# Altium schematic sheet FRONT_PL_v1.SchDoc: SDR200
size 420 x 297 mm; DocumentNumber: XXXX.468179.001 Э3; SheetNumber: 2; SheetTotal: 7; Title2str: Передняя панель; DocumentType: Схема электрическая принципиальная; Scale: 1:1
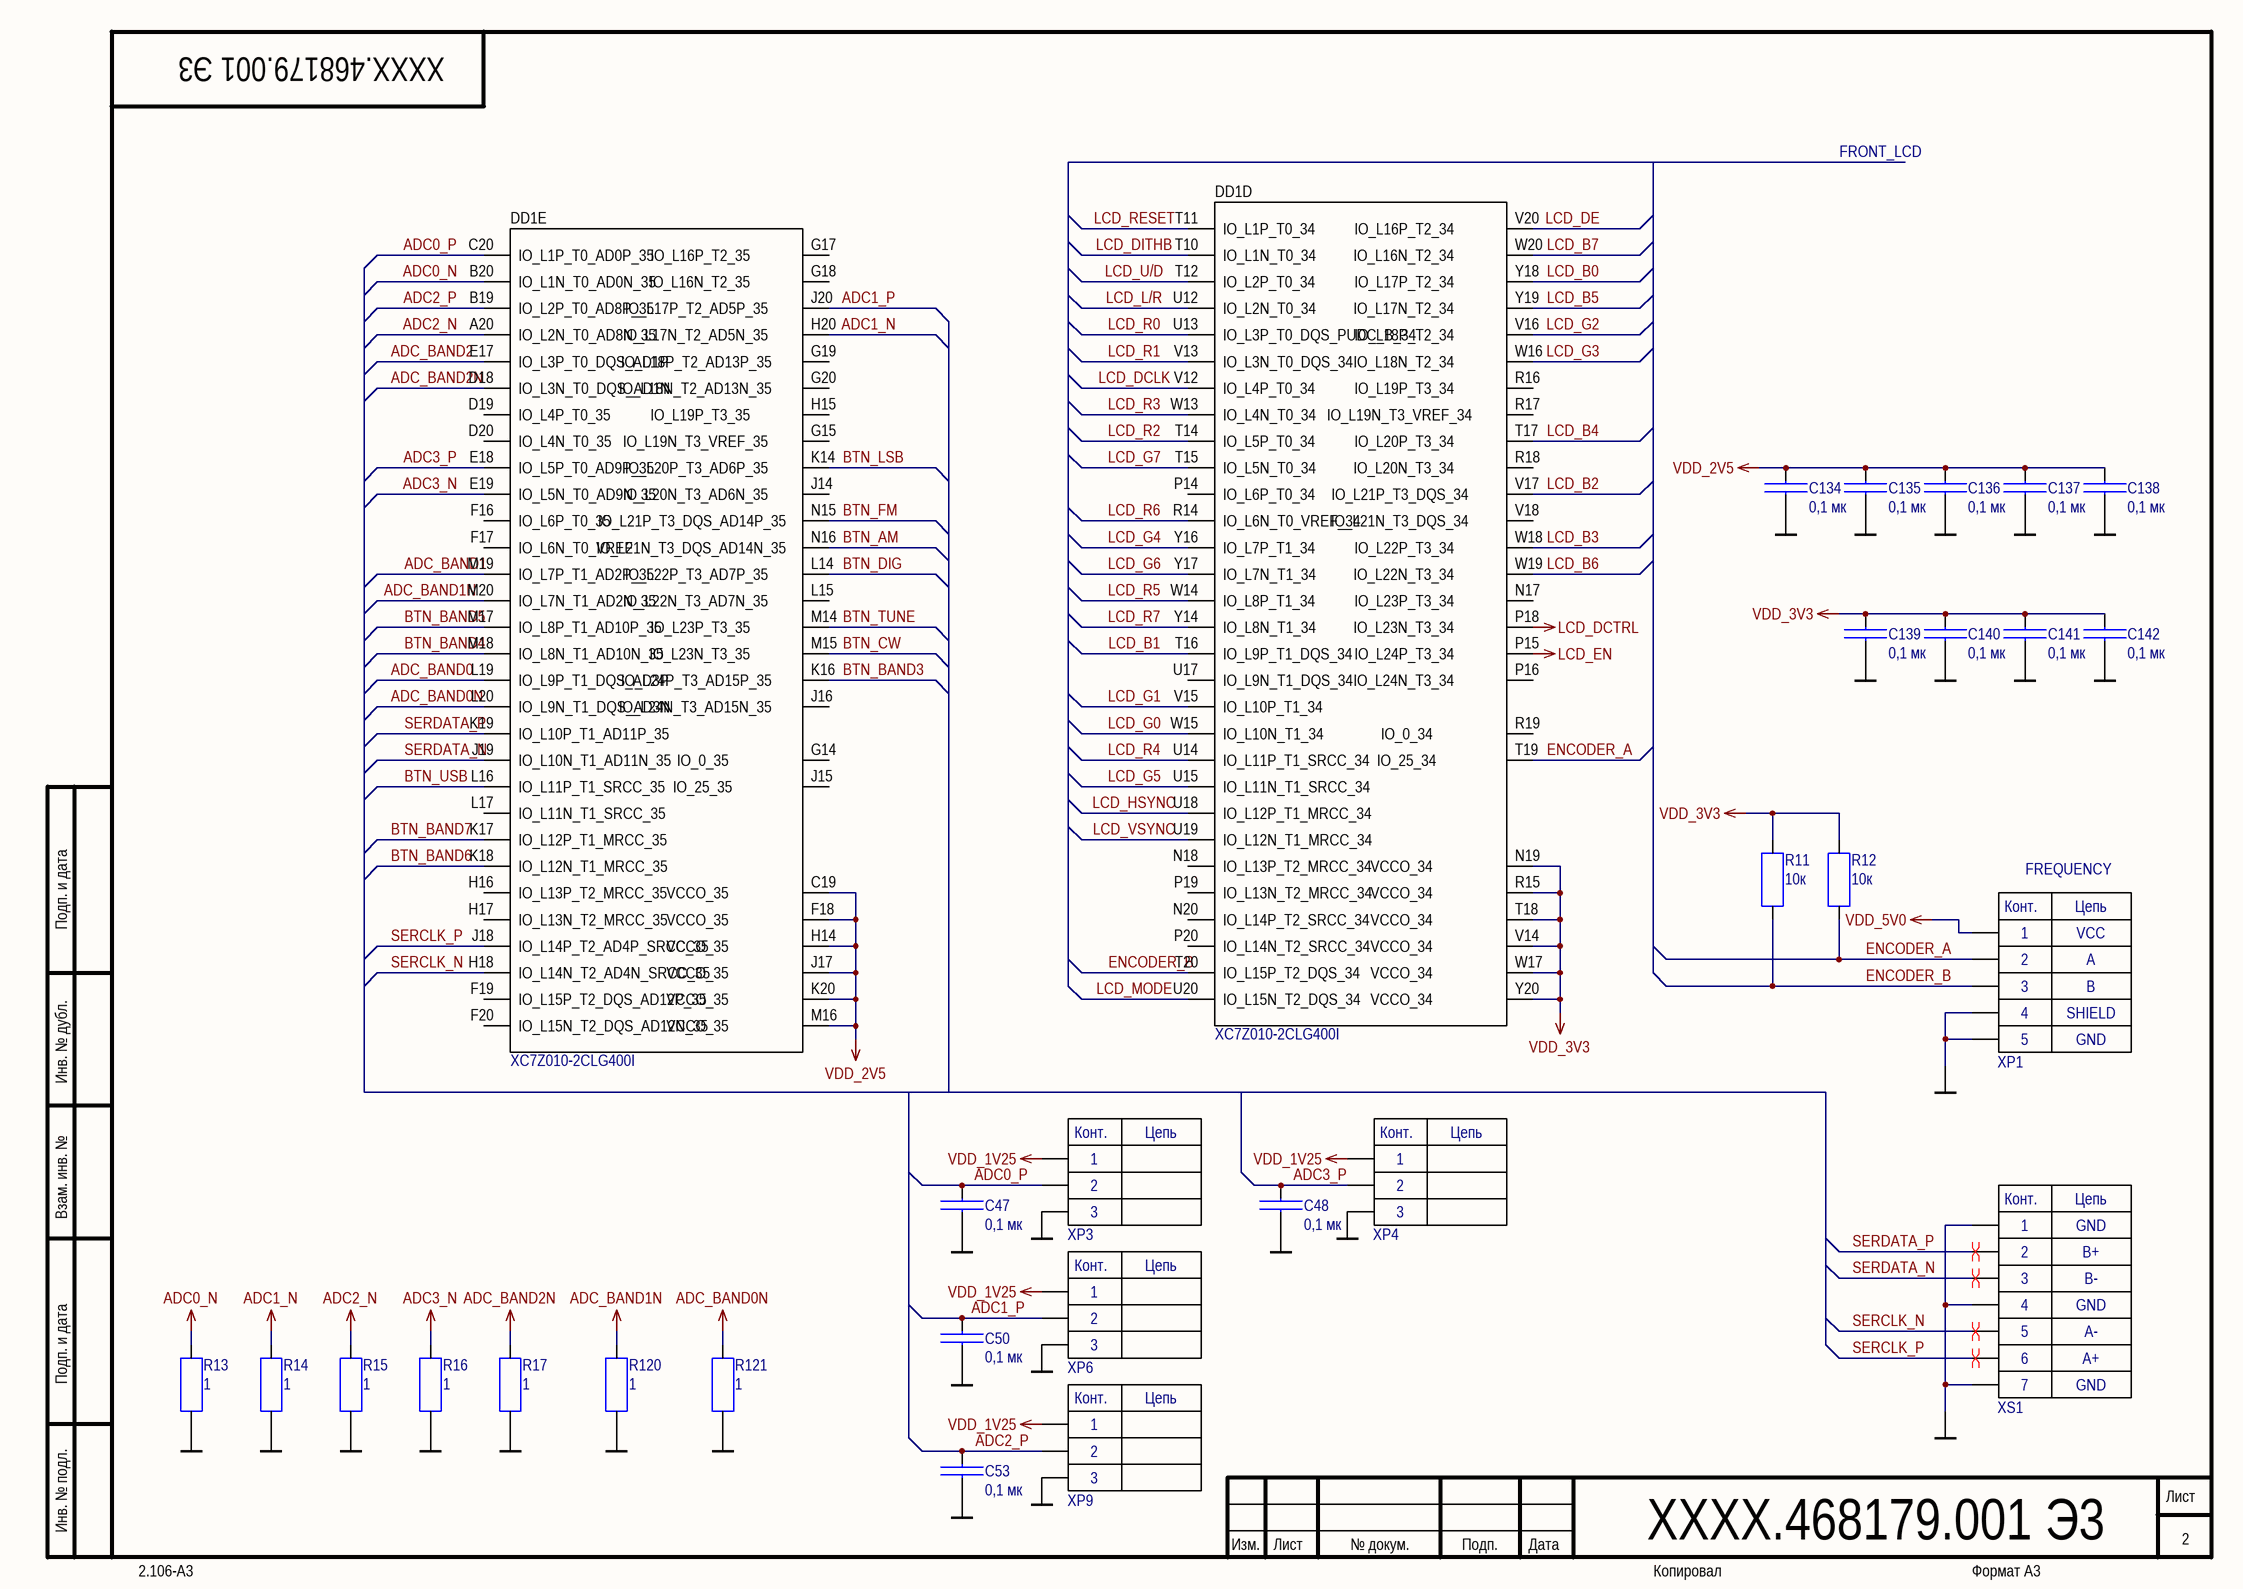
[diagram p0: FRONT_PL_v1.SchDoc]

## Parts
C47  Nominal: 0,1 мк  [CAPC1005X05L]  (hidden comment: CC0402KRX5R6BB104)
C48  Nominal: 0,1 мк  [CAPC1005X05L]  (hidden comment: CC0402KRX5R6BB104)
C50  Nominal: 0,1 мк  [CAPC1005X05L]  (hidden comment: CC0402KRX5R6BB104)
C53  Nominal: 0,1 мк  [CAPC1005X05L]  (hidden comment: CC0402KRX5R6BB104)
C134  Nominal: 0,1 мк  [CAPC1005X05L]  (hidden comment: CC0402KRX5R6BB104)
C135  Nominal: 0,1 мк  [CAPC1005X05L]  (hidden comment: CC0402KRX5R6BB104)
C136  Nominal: 0,1 мк  [CAPC1005X05L]  (hidden comment: CC0402KRX5R6BB104)
C137  Nominal: 0,1 мк  [CAPC1005X05L]  (hidden comment: CC0402KRX5R6BB104)
C138  Nominal: 0,1 мк  [CAPC1005X05L]  (hidden comment: CC0402KRX5R6BB104)
C139  Nominal: 0,1 мк  [CAPC1005X05L]  (hidden comment: CC0402KRX5R6BB104)
C140  Nominal: 0,1 мк  [CAPC1005X05L]  (hidden comment: CC0402KRX5R6BB104)
C141  Nominal: 0,1 мк  [CAPC1005X05L]  (hidden comment: CC0402KRX5R6BB104)
C142  Nominal: 0,1 мк  [CAPC1005X05L]  (hidden comment: CC0402KRX5R6BB104)
DD1  XC7Z010-2CLG400I  [BGA400C80P20X20_1700X1700X147]  (parts D,E of 7)
R11  Nominal: 10к  [RESC1005X04L]  (hidden comment: RC0402JR-0710KL)
R12  Nominal: 10к  [RESC1005X04L]  (hidden comment: RC0402JR-0710KL)
R13  Nominal: 1  [RESC1005X04L]  (hidden comment: RC0402JR-071RL)
R14  Nominal: 1  [RESC1005X04L]  (hidden comment: RC0402JR-071RL)
R15  Nominal: 1  [RESC1005X04L]  (hidden comment: RC0402JR-071RL)
R16  Nominal: 1  [RESC1005X04L]  (hidden comment: RC0402JR-071RL)
R17  Nominal: 1  [RESC1005X04L]  (hidden comment: RC0402JR-071RL)
R120  Nominal: 1  [RESC1005X04L]  (hidden comment: RC0402JR-071RL)
R121  Nominal: 1  [RESC1005X04L]  (hidden comment: RC0402JR-071RL)
XP1  WB-05  [WB-05 (MW-5M) pitch 2.00mm]  (value not drawn)
XP3  WB-03  [WB-03 (MW-3M) PITCH 2.00MM]  (value not drawn)
XP4  WB-03  [WB-03 (MW-3M) PITCH 2.00MM]  (value not drawn)
XP6  WB-03  [WB-03 (MW-3M) PITCH 2.00MM]  (value not drawn)
XP9  WB-03  [WB-03 (MW-3M) PITCH 2.00MM]  (value not drawn)
XS1  KLS1-SATA001  [KLS1-SATA001]  (value not drawn)

## Nets
ADC0_N: DD1.B20(IO_L1N_T0_AD0N_35) R13.2
ADC1_N: DD1.H20(IO_L17N_T2_AD5N_35) R14.2
ADC2_N: DD1.A20(IO_L2N_T0_AD8N_35) R15.2
ADC3_N: DD1.E19(IO_L5N_T0_AD9N_35) R16.2
ADC_BAND0N: DD1.L20(IO_L9N_T1_DQS_AD3N) R121.2
ADC_BAND1N: DD1.M20(IO_L7N_T1_AD2N_35) R120.2
ADC_BAND2N: DD1.D18(IO_L3N_T0_DQS_AD1N) R17.2
GND: C47.1 C48.1 C50.1 C53.1 C134.1 C135.1 C136.1 C137.1 C138.1 C139.1 C140.1 C141.1 C142.1 R13.1 R14.1 R15.1 R16.1 R17.1 R120.1 R121.1 XP1.4 XP1.5 XP3.3 XP4.3 XP6.3 XP9.3 XS1.1 XS1.4 XS1.7
LCD_DCTRL: DD1.P18(IO_L23N_T3_34)
LCD_EN: DD1.P15(IO_L24P_T3_34)
VDD_1V25: XP3.1 XP4.1 XP6.1 XP9.1
VDD_2V5: C134.2 C135.2 C136.2 C137.2 C138.2 DD1.C19(VCCO_35) DD1.F18(VCCO_35) DD1.H14(VCCO_35) DD1.J17(VCCO_35) DD1.K20(VCCO_35) DD1.M16(VCCO_35)
VDD_3V3: C139.2 C140.2 C141.2 C142.2 DD1.N19(VCCO_34) DD1.R15(VCCO_34) DD1.T18(VCCO_34) DD1.V14(VCCO_34) DD1.W17(VCCO_34) DD1.Y20(VCCO_34) R11.1 R12.1
VDD_5V0: XP1.1
ADC0_P: C47.2 DD1.C20(IO_L1P_T0_AD0P_35) XP3.2
ADC1_P: C50.2 DD1.J20(IO_L17P_T2_AD5P_35) XP6.2
ADC2_P: C53.2 DD1.B19(IO_L2P_T0_AD8P_35) XP9.2
ADC3_P: C48.2 DD1.E18(IO_L5P_T0_AD9P_35) XP4.2
ADC_BAND0: DD1.L19(IO_L9P_T1_DQS_AD3P)
ADC_BAND1: DD1.M19(IO_L7P_T1_AD2P_35)
ADC_BAND2: DD1.E17(IO_L3P_T0_DQS_AD1P)
BTN_AM: DD1.N16(IO_L21N_T3_DQS_AD14N_35)
BTN_BAND3: DD1.K16(IO_L24P_T3_AD15P_35)
BTN_BAND4: DD1.M18(IO_L8N_T1_AD10N_35)
BTN_BAND5: DD1.M17(IO_L8P_T1_AD10P_35)
BTN_BAND6: DD1.K18(IO_L12N_T1_MRCC_35)
BTN_BAND7: DD1.K17(IO_L12P_T1_MRCC_35)
BTN_CW: DD1.M15(IO_L23N_T3_35)
BTN_DIG: DD1.L14(IO_L22P_T3_AD7P_35)
BTN_FM: DD1.N15(IO_L21P_T3_DQS_AD14P_35)
BTN_LSB: DD1.K14(IO_L20P_T3_AD6P_35)
BTN_TUNE: DD1.M14(IO_L23P_T3_35)
BTN_USB: DD1.L16(IO_L11P_T1_SRCC_35)
ENCODER_A: DD1.T19(IO_25_34) R12.2 XP1.2
ENCODER_B: DD1.T20(IO_L15P_T2_DQS_34) R11.2 XP1.3
LCD_B0: DD1.Y18(IO_L17P_T2_34)
LCD_B1: DD1.T16(IO_L9P_T1_DQS_34)
LCD_B2: DD1.V17(IO_L21P_T3_DQS_34)
LCD_B3: DD1.W18(IO_L22P_T3_34)
LCD_B4: DD1.T17(IO_L20P_T3_34)
LCD_B5: DD1.Y19(IO_L17N_T2_34)
LCD_B6: DD1.W19(IO_L22N_T3_34)
LCD_B7: DD1.W20(IO_L16N_T2_34)
LCD_DCLK: DD1.V12(IO_L4P_T0_34)
LCD_DE: DD1.V20(IO_L16P_T2_34)
LCD_DITHB: DD1.T10(IO_L1N_T0_34)
LCD_G0: DD1.W15(IO_L10N_T1_34)
LCD_G1: DD1.V15(IO_L10P_T1_34)
LCD_G2: DD1.V16(IO_L18P_T2_34)
LCD_G3: DD1.W16(IO_L18N_T2_34)
LCD_G4: DD1.Y16(IO_L7P_T1_34)
LCD_G5: DD1.U15(IO_L11N_T1_SRCC_34)
LCD_G6: DD1.Y17(IO_L7N_T1_34)
LCD_G7: DD1.T15(IO_L5N_T0_34)
LCD_HSYNC: DD1.U18(IO_L12P_T1_MRCC_34)
LCD_L/R: DD1.U12(IO_L2N_T0_34)
LCD_MODE: DD1.U20(IO_L15N_T2_DQS_34)
LCD_R0: DD1.U13(IO_L3P_T0_DQS_PUDC_B_34)
LCD_R1: DD1.V13(IO_L3N_T0_DQS_34)
LCD_R2: DD1.T14(IO_L5P_T0_34)
LCD_R3: DD1.W13(IO_L4N_T0_34)
LCD_R4: DD1.U14(IO_L11P_T1_SRCC_34)
LCD_R5: DD1.W14(IO_L8P_T1_34)
LCD_R6: DD1.R14(IO_L6N_T0_VREF_34)
LCD_R7: DD1.Y14(IO_L8N_T1_34)
LCD_RESET: DD1.T11(IO_L1P_T0_34)
LCD_U/D: DD1.T12(IO_L2P_T0_34)
LCD_VSYNC: DD1.U19(IO_L12N_T1_MRCC_34)
SERCLK_N: DD1.H18(IO_L14N_T2_AD4N_SRCC_35) XS1.5
SERCLK_P: DD1.J18(IO_L14P_T2_AD4P_SRCC_35) XS1.6
SERDATA_N: DD1.J19(IO_L10N_T1_AD11N_35) XS1.3
SERDATA_P: DD1.K19(IO_L10P_T1_AD11P_35) XS1.2

Not connected (* = marked no-connect by the designer): DD1 D19  (IO_L4P_T0_35_____________) D20  (IO_L4N_T0_35_____________) F16  (IO_L6P_T0_35_____________) F17  (IO_L6N_T0_VREF) F19  (IO_L15P_T2_DQS_AD12P_35__) F20  (IO_L15N_T2_DQS_AD12N_35__) G14  (IO_0_35__________________) G15  (IO_L19N_T3_VREF_35_______) G17  (IO_L16P_T2_35____________) G18  (IO_L16N_T2_35____________) G19  (IO_L18P_T2_AD13P_35______) G20  (IO_L18N_T2_AD13N_35______) H15  (IO_L19P_T3_35____________) H16  (IO_L13P_T2_MRCC_35_______) H17  (IO_L13N_T2_MRCC_35_______) J14  (IO_L20N_T3_AD6N_35_______) J15  (IO_25_35_________________) J16  (IO_L24N_T3_AD15N_35______) L15  (IO_L22N_T3_AD7N_35_______) L17  (IO_L11N_T1_SRCC_35_______) N17  (IO_L23P_T3_34____________) N18  (IO_L13P_T2_MRCC_34_______) N20  (IO_L14P_T2_SRCC_34_______) P14  (IO_L6P_T0_34_____________) P16  (IO_L24N_T3_34____________) P19  (IO_L13N_T2_MRCC_34_______) P20  (IO_L14N_T2_SRCC_34_______) R16  (IO_L19P_T3_34____________) R17  (IO_L19N_T3_VREF_34_______) R18  (IO_L20N_T3_34____________) R19  (IO_0_34__________________) U17  (IO_L9N_T1_DQS_34_________) V18  (IO_L21N_T3_DQS_34________)

## Layout directives
differential pair: SERCLK_N, SERCLK_P, SERDATA_N, SERDATA_P

## Notes on the sheet
- FRONT_LCD
- FREQUENCY
- VCC
- A
- B
- GND
- SHIELD
- Подп. и дата
- Инв. № дубл.
- Взам. инв. №
- Инв. № подл.
- Изм.
- Лист
- № докум.
- Подп.
- Дата
- 2.106-A3
- Копировал
- Формат А3
- (in symbol SATA KLS1-SATA001) Конт.; Цепь; GND; B+; B-; A-; A+
- (in symbol WB-03) Конт.; Цепь
- (in symbol WB-05) Конт.; Цепь

## Library data of the parts
C47 C48 C50 C53 C134-C142 = CC0402KRX5R6BB104: ЧИП конденсатор; Manufacturer: Yageo; ID: 0402 0,1 мкФ 10В X7R; Tolerance: 10%; Type: X7R; Value: 0402 0,1 мкФ 10В X7R; RuNominal: 0,1 мкФ; Voltage: 10В; ManufacturerPartNumber: CC0402KRX5R6BB104; Rem: *
DD1 = XC7Z010-2CLG400I: Zynq®-7000 SoC Family; Manufacturer: Xilinx; ManufacturerPartNumber: XC7Z010-2CLG400I; Value: XC7Z010-2CLG400I
R11 R12 = RC0402JR-0710KL: ЧИП резистор; Manufacturer: Yageo; ID: 0402 10 кОм 5%; Tolerance: 5%; Value: 0402 10 кОм 5%; ManufacturerPartNumber: RC0402JR-0710KL; Rem: *; Type: *
R13-R17 R120 R121 = RC0402JR-071RL: ЧИП резистор; Manufacturer: Yageo; ID: 0402 1 Ом 5%; Tolerance: 5%; Value: 0402 1 Ом 5%; ManufacturerPartNumber: RC0402JR-071RL; Rem: *; Type: *
XP1 = WB-05: WB-05 (MW-5M) pitch 2.00mm / DS1066-05M; ManufacturerPartNumber: WB-05
XP3 XP4 XP6 XP9 = WB-03: WB-03(MW-3M) pitch 2.00mm / DS1066-03M
XS1 = SATA KLS1-SATA001: SATA Type A 7P Male Connector,SMD